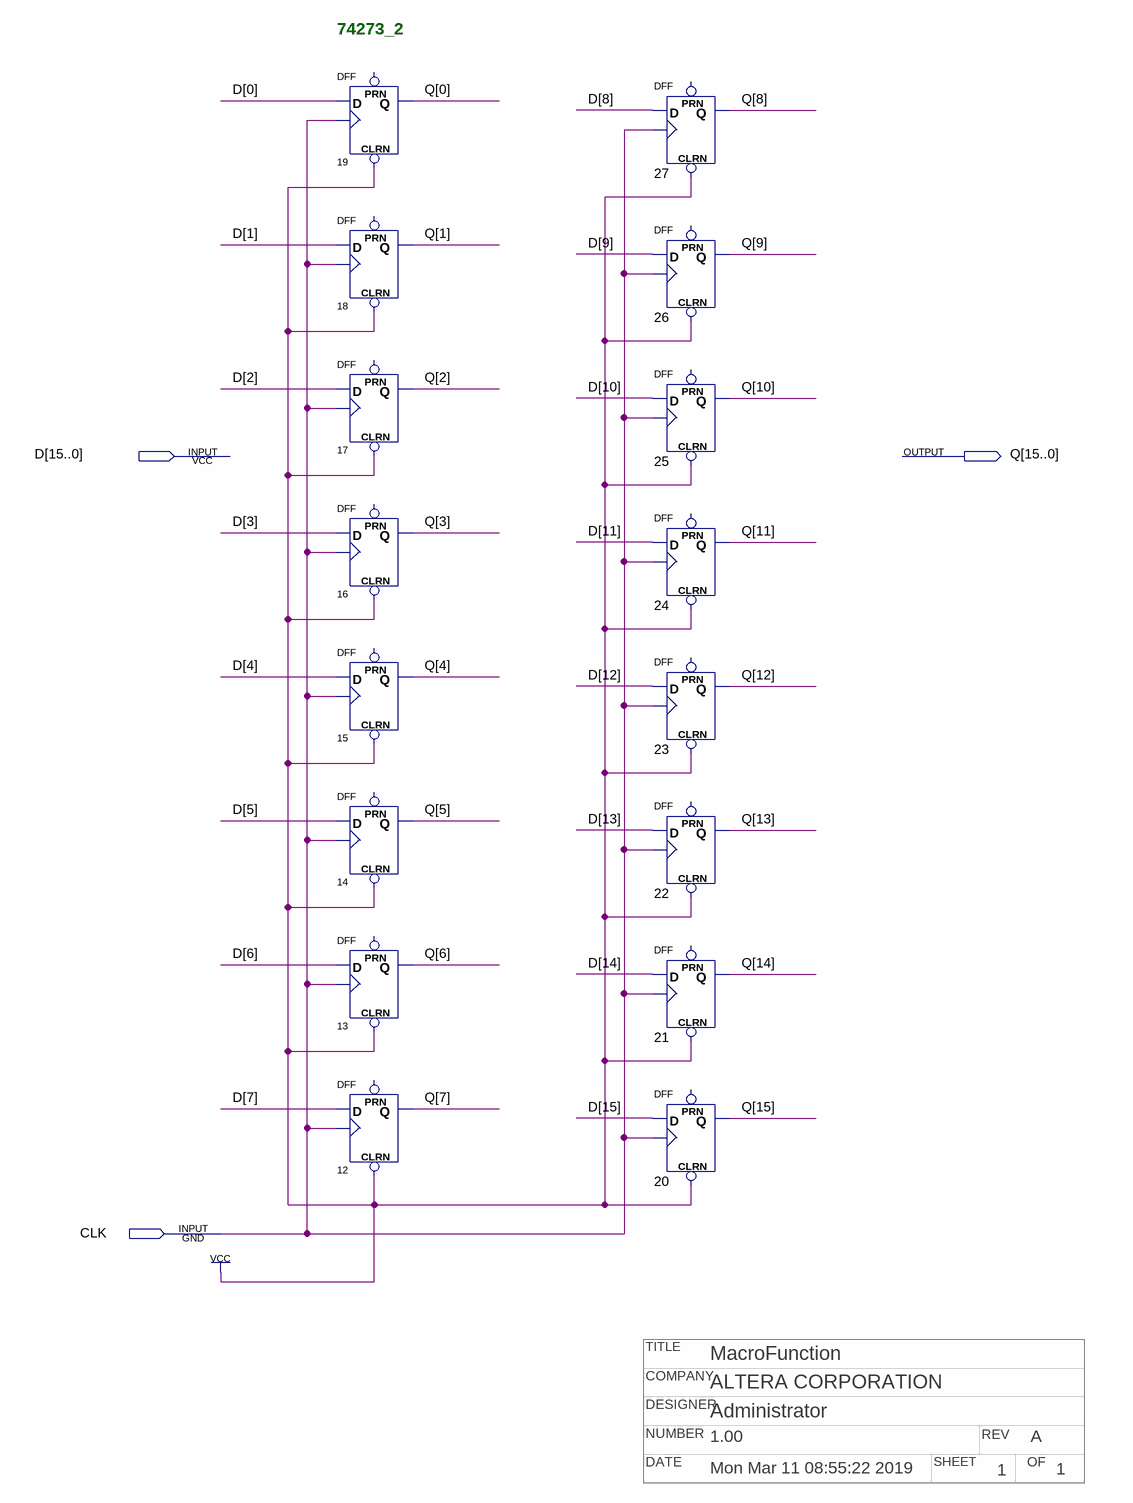
[diagram p0: schematic sheet]
// Quartus schematic 273_2.bdf as structural Verilog: 16 symbols, 3 pins
// Title block: TITLE: MacroFunction; COMPANY: ALTERA CORPORATION; DESIGNER: Administrator; NUMBER: 1.00; REV: A; DATE: Mon Mar 11 08:55:22 2019; SHEET: 1; OF: 1
module \273_2  (
  input  [15:0] D,
  input  CLK,
  output [15:0] Q
);

  DFF u_19 (.CLRN(1'b1), .CLK(CLK), .D(D[0]), .Q(Q[0]));  // open: PRN
  DFF u_18 (.CLRN(1'b1), .CLK(CLK), .D(D[1]), .Q(Q[1]));  // open: PRN
  DFF u_17 (.CLRN(1'b1), .CLK(CLK), .D(D[2]), .Q(Q[2]));  // open: PRN
  DFF u_16 (.CLRN(1'b1), .CLK(CLK), .D(D[3]), .Q(Q[3]));  // open: PRN
  DFF u_15 (.CLRN(1'b1), .CLK(CLK), .D(D[4]), .Q(Q[4]));  // open: PRN
  DFF u_14 (.CLRN(1'b1), .CLK(CLK), .D(D[5]), .Q(Q[5]));  // open: PRN
  DFF u_13 (.CLRN(1'b1), .CLK(CLK), .D(D[6]), .Q(Q[6]));  // open: PRN
  DFF u_12 (.CLRN(1'b1), .CLK(CLK), .D(D[7]), .Q(Q[7]));  // open: PRN
  DFF u_27 (.CLRN(1'b1), .CLK(CLK), .D(D[8]), .Q(Q[8]));  // open: PRN
  DFF u_26 (.CLRN(1'b1), .CLK(CLK), .D(D[9]), .Q(Q[9]));  // open: PRN
  DFF u_25 (.CLRN(1'b1), .CLK(CLK), .D(D[10]), .Q(Q[10]));  // open: PRN
  DFF u_24 (.CLRN(1'b1), .CLK(CLK), .D(D[11]), .Q(Q[11]));  // open: PRN
  DFF u_23 (.CLRN(1'b1), .CLK(CLK), .D(D[12]), .Q(Q[12]));  // open: PRN
  DFF u_22 (.CLRN(1'b1), .CLK(CLK), .D(D[13]), .Q(Q[13]));  // open: PRN
  DFF u_21 (.CLRN(1'b1), .CLK(CLK), .D(D[14]), .Q(Q[14]));  // open: PRN
  DFF u_20 (.CLRN(1'b1), .CLK(CLK), .D(D[15]), .Q(Q[15]));  // open: PRN

  // Notes on the sheet:
  //   74273_2
endmodule
